# EAGLE design usbToSerial (EAGLE 6.1)
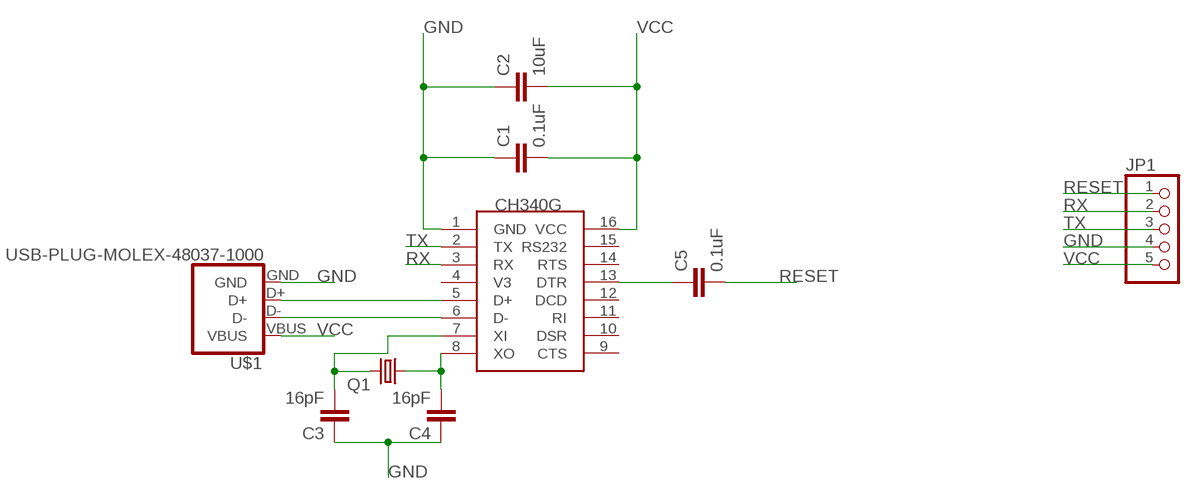
[diagram p0: schematic, sheet 1]

## Parts
C1  0.1uF  C-EUC0603  [C0603]
C2  10uF  C-EUC3216  [C3216]
C3  16pF  C-EUC0603  [C0603]
C4  16pF  C-EUC0603  [C0603]
C5  0.1uF  C-EUC0603  [C0603]
JP1  PINHD-1X5/90  [1X05/90]
Q1  CRYSTALSM49  [SM49]
U$1  USB-PLUG-MOLEX-48037-1000  [MOLEX-48037-1000]
U$2  CH340G  [SOIC16]

## Nets
GND: C1.1 C2.1 C3.1 C4.1 JP1.4 U$1.GND U$2.1(GND)
N$1: U$1.D+ U$2.5(D+)
N$2: U$1.D- U$2.6(D-)
N$3: C3.2 Q1.2 U$2.7(XI)
N$4: C4.2 Q1.1 U$2.8(XO)
N$5: C5.1 U$2.13(DTR)
RESET: C5.2 JP1.1
RX: JP1.2 U$2.3(RX)
TX: JP1.3 U$2.2(TX)
VCC: C1.2 C2.2 JP1.5 U$1.VBUS U$2.16(VCC)
Unconnected: U$2.4(V3) U$2.9(CTS) U$2.10(DSR) U$2.11(RI) U$2.12(DCD) U$2.14(RTS) U$2.15(RS232)

## Library data of the parts
C1 C3-C5 = rcl:C-EU: CAPACITOR, European symbol
C2 = resistor:C-EU: CAPACITOR, European symbol
JP1 = pinhead:PINHD-1X5: PIN HEADER
Q1 = crystal:CRYSTAL: CRYSTAL; OC_FARNELL: unknown; OC_NEWARK: unknown
U$1 = daspilker:USB-PLUG
U$2 = ch340g:CH340G

## Board
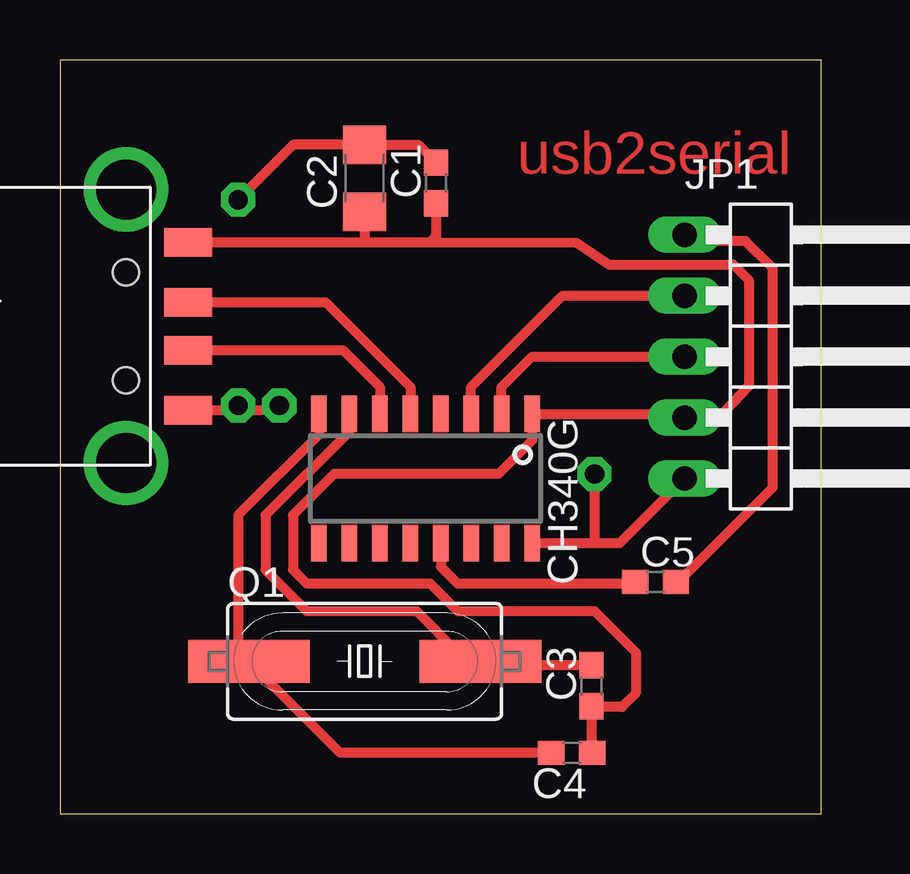
[diagram p1: board, top side]
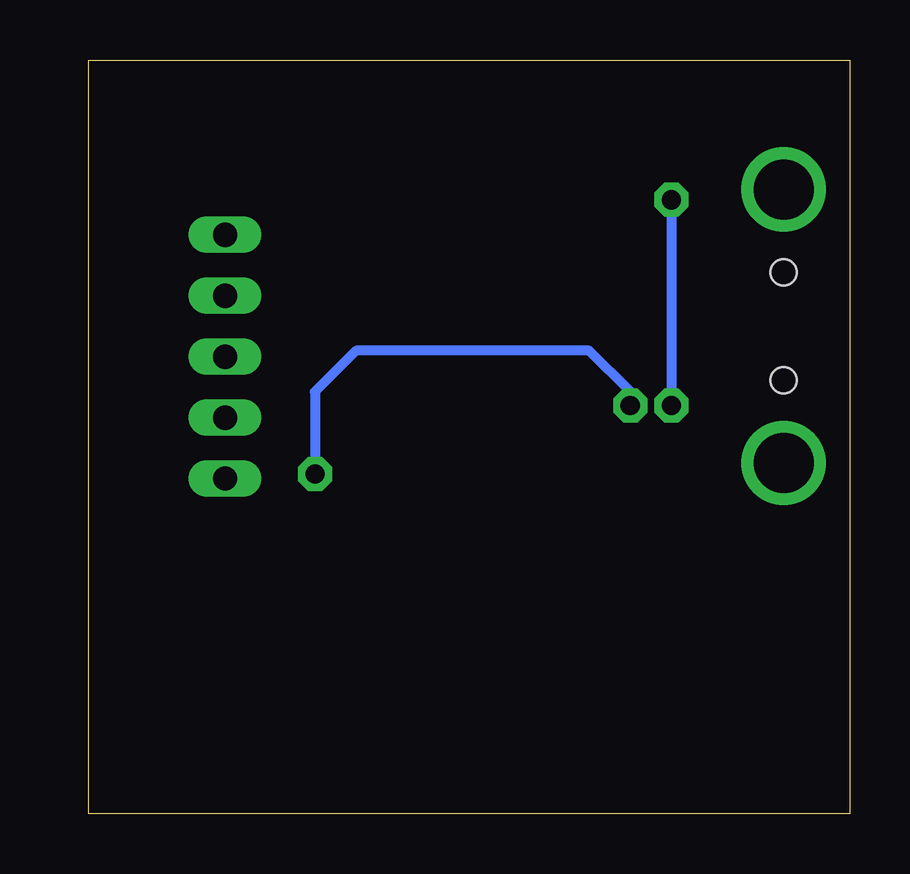
[diagram p2: board, bottom side, seen from below]

Size 31.73 x 31.42 mm. Coordinates in mm from the lower left corner, seen from the top.
Outline: 0,0 31.73,0 31.73,31.42 0,31.42 0,0
Copper layers (1*16): Top 0.035mm / dielectric 1.5mm / Bottom 0.035mm
Design rules: minimum track width 10mil, minimum drill 24mil, track to track 8mil, track to pad 8mil, pad to pad 8mil, via to via 8mil, smd to smd 8mil, copper to edge 40mil, drill to drill 8mil, minimum pad ring 10mil, minimum via ring 8mil, stop-mask expansion 4mil, vias tented up to drill 0mil, thermal gap 10mil

### Footprints (pad centres in the part's own frame; a part is rotated, then mirrored left to right if it is on the bottom)
C0603 = smd 1.1 x 1: 1 -0.85,0; 2 0.85,0
C3216 = smd 1.6 x 1.8: 1 -1.4,0; 2 1.4,0
1X05/90 = drill 1.016 long: 1 -5.08,-3.81; 2 -2.54,-3.81; 3 0,-3.81; 4 2.54,-3.81; 5 5.08,-3.81
SM49 = smd 5.08 x 1.778: 1 -4.826,0; 2 4.826,0
MOLEX-48037-1000 = smd 1.2 x 2: D+ -1,5.35; D- 1,5.35; GND -3.5,5.35; VBUS 3.5,5.35 | drill 2.5: M1 -5.7,2.75; M2 5.7,2.75 | hole 1.1: -2.25,2.75; 2.25,2.75
SOIC16 = smd 0.635 x 1.524: 1 -4.445,-2.695; 2 -3.175,-2.695; 3 -1.905,-2.695; 4 -0.635,-2.695; 5 0.635,-2.695; 6 1.905,-2.695; 7 3.175,-2.695; 8 4.445,-2.695; 9 4.445,2.695; 10 3.175,2.695; 11 1.905,2.695; 12 0.635,2.695; 13 -0.635,2.695; 14 -1.905,2.695; 15 -3.175,2.695; 16 -4.445,2.695

### Placement (x,y rotation side)
C1  15.68,26.29 90 top
C2  12.7,26.48 90 top
C3  22.16,5.33 90 top
C4  21.34,2.54 180 top
C5  24.83,9.65 0 top
JP1  29.84,19.05 270 top
Q1  12.7,6.35 0 top
U$1  0,20.32 270 top
U$2  15.24,13.97 180 top

### Tracks (layer width: path | path; a pad name or v marks a point on that pad's centre or on a via)
GND
  Top 0.406: C4.1 22.16,2.56 C3.1 22.2,4.45 23.43,4.45 24,5.02 24,6.73 22.29,8.45 16.57,8.45 15.43,9.59 10.29,9.59 9.72,10.16 9.72,12.45 11.43,14.16 18.29,14.16 19.68,15.56 U$2.1 25.88,16.66 JP1.4 26.1,16.45 27.43,16.45 28.71,17.83 28.72,22.25 28.06,22.89 22.88,22.9 21.52,23.8 15.43,23.82 | U$1.GND 12.57,23.82 | 12.57,23.82 15.43,23.82 | C2.1 12.7,23.95 12.57,23.82 | C1.1 15.68,24.07 15.43,23.82
N$1
  Top 0.406: U$1.D+ 11.06,21.32 14.61,17.78 U$2.5
N$2
  Top 0.406: U$1.D- 11.79,19.32 13.34,17.78 U$2.6
N$3
  Top 0.406: U$2.7 12.06,15.94 8.57,12.45 8.57,10.16 10.29,8.45 14.86,8.45 16.57,6.73 17.14,6.73 Q1.2 17.69,6.18 C3.2
N$4
  Top 0.406: U$2.8 10.79,15.81 7.43,12.45 7.43,6.79 Q1.1 11.68,2.54 C4.2
N$5
  Top 0.406: U$2.13 15.88,10.29 16.57,9.59 23.91,9.59 C5.1
RESET
  Top 0.406: C5.2 25.78,9.65 29.72,13.59 29.72,22.73 28.57,23.88 26.29,23.88 JP1.1
RX
  Top 0.406: U$2.3 17.14,17.78 20.95,21.59 JP1.2
TX
  Top 0.406: U$2.2 18.41,17.78 19.68,19.05 JP1.3
VCC  (via drill 0.8 pad 1.42)
  Top 0.406: U$2.16 22.29,11.28 | 22.29,11.28 23.34,11.28 JP1.5 | U$1.VBUS 7.43,16.82 | 7.43,16.82 8.37,16.82 v9.14,17.02 | v22.29,14.16 22.29,11.28 | v7.43,25.59 9.72,27.88 C2.2 14.94,27.88 C1.2 | v7.43,17.02 7.43,16.82
  Bottom 0.406: v9.14,17.02 9.14,17.59 10.86,19.3 20.57,19.3 22.29,17.59 v22.29,14.16 | v7.43,25.59 v7.43,17.02

### Text on the board
Top: usb2serial